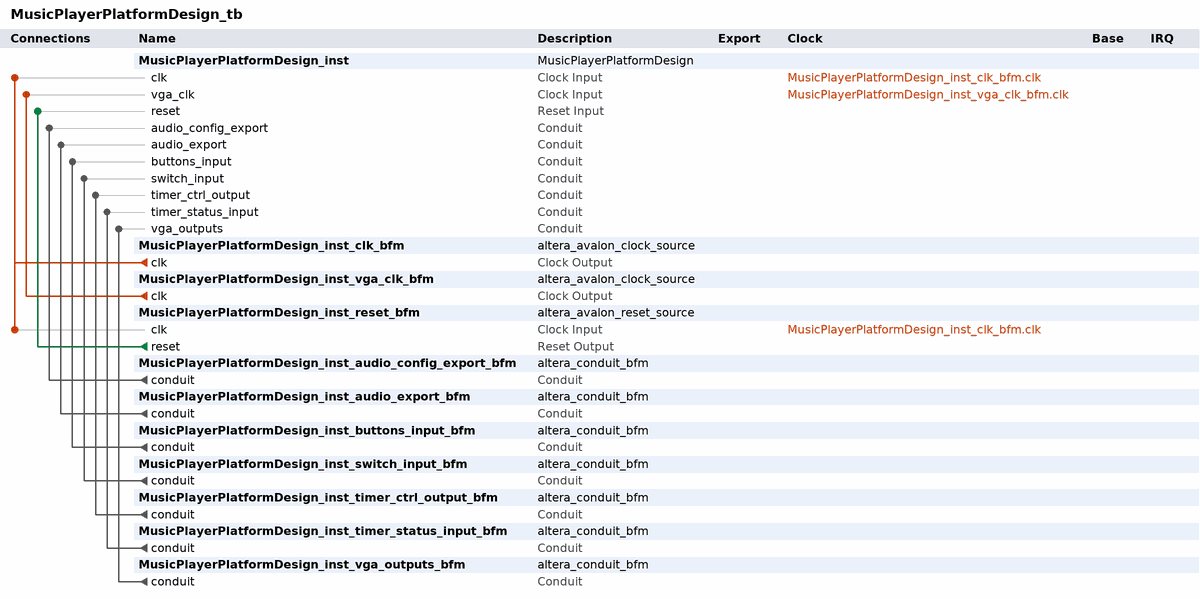
[diagram p0: system contents]
# Platform Designer (Qsys) system MusicPlayerPlatformDesign_tb, Cyclone V 5CSEMA5F31C6
# Parameters at their usual value, and those the tool derives, are not listed.
package require -exact qsys 22.1
create_system MusicPlayerPlatformDesign_tb
set_project_property DEVICE_FAMILY {Cyclone V}
set_project_property DEVICE 5CSEMA5F31C6

add_instance MusicPlayerPlatformDesign_inst MusicPlayerPlatformDesign 1.0

add_instance MusicPlayerPlatformDesign_inst_clk_bfm altera_avalon_clock_source 22.1

add_instance MusicPlayerPlatformDesign_inst_vga_clk_bfm altera_avalon_clock_source 22.1

add_instance MusicPlayerPlatformDesign_inst_reset_bfm altera_avalon_reset_source 22.1
set_instance_parameter_value MusicPlayerPlatformDesign_inst_reset_bfm ASSERT_HIGH_RESET 0
set_instance_parameter_value MusicPlayerPlatformDesign_inst_reset_bfm INITIAL_RESET_CYCLES 50

add_instance MusicPlayerPlatformDesign_inst_audio_config_export_bfm altera_conduit_bfm 22.1
set_instance_parameter_value MusicPlayerPlatformDesign_inst_audio_config_export_bfm CLOCKED_SIGNAL false
set_instance_parameter_value MusicPlayerPlatformDesign_inst_audio_config_export_bfm ENABLE_RESET false
set_instance_parameter_value MusicPlayerPlatformDesign_inst_audio_config_export_bfm SIGNAL_DIRECTIONS input,bidir
set_instance_parameter_value MusicPlayerPlatformDesign_inst_audio_config_export_bfm SIGNAL_ROLES SCLK,SDAT
set_instance_parameter_value MusicPlayerPlatformDesign_inst_audio_config_export_bfm SIGNAL_WIDTHS 1,1

add_instance MusicPlayerPlatformDesign_inst_audio_export_bfm altera_conduit_bfm 22.1
set_instance_parameter_value MusicPlayerPlatformDesign_inst_audio_export_bfm CLOCKED_SIGNAL false
set_instance_parameter_value MusicPlayerPlatformDesign_inst_audio_export_bfm ENABLE_RESET false
set_instance_parameter_value MusicPlayerPlatformDesign_inst_audio_export_bfm SIGNAL_DIRECTIONS output,input,output
set_instance_parameter_value MusicPlayerPlatformDesign_inst_audio_export_bfm SIGNAL_ROLES BCLK,DACDAT,DACLRCK
set_instance_parameter_value MusicPlayerPlatformDesign_inst_audio_export_bfm SIGNAL_WIDTHS 1,1,1

add_instance MusicPlayerPlatformDesign_inst_buttons_input_bfm altera_conduit_bfm 22.1
set_instance_parameter_value MusicPlayerPlatformDesign_inst_buttons_input_bfm CLOCKED_SIGNAL false
set_instance_parameter_value MusicPlayerPlatformDesign_inst_buttons_input_bfm ENABLE_RESET false
set_instance_parameter_value MusicPlayerPlatformDesign_inst_buttons_input_bfm SIGNAL_DIRECTIONS output
set_instance_parameter_value MusicPlayerPlatformDesign_inst_buttons_input_bfm SIGNAL_WIDTHS 4

add_instance MusicPlayerPlatformDesign_inst_switch_input_bfm altera_conduit_bfm 22.1
set_instance_parameter_value MusicPlayerPlatformDesign_inst_switch_input_bfm CLOCKED_SIGNAL false
set_instance_parameter_value MusicPlayerPlatformDesign_inst_switch_input_bfm ENABLE_RESET false
set_instance_parameter_value MusicPlayerPlatformDesign_inst_switch_input_bfm SIGNAL_DIRECTIONS output
set_instance_parameter_value MusicPlayerPlatformDesign_inst_switch_input_bfm SIGNAL_WIDTHS 1

add_instance MusicPlayerPlatformDesign_inst_timer_ctrl_output_bfm altera_conduit_bfm 22.1
set_instance_parameter_value MusicPlayerPlatformDesign_inst_timer_ctrl_output_bfm CLOCKED_SIGNAL false
set_instance_parameter_value MusicPlayerPlatformDesign_inst_timer_ctrl_output_bfm ENABLE_RESET false
set_instance_parameter_value MusicPlayerPlatformDesign_inst_timer_ctrl_output_bfm SIGNAL_DIRECTIONS input
set_instance_parameter_value MusicPlayerPlatformDesign_inst_timer_ctrl_output_bfm SIGNAL_WIDTHS 2

add_instance MusicPlayerPlatformDesign_inst_timer_status_input_bfm altera_conduit_bfm 22.1
set_instance_parameter_value MusicPlayerPlatformDesign_inst_timer_status_input_bfm CLOCKED_SIGNAL false
set_instance_parameter_value MusicPlayerPlatformDesign_inst_timer_status_input_bfm ENABLE_RESET false
set_instance_parameter_value MusicPlayerPlatformDesign_inst_timer_status_input_bfm SIGNAL_DIRECTIONS output
set_instance_parameter_value MusicPlayerPlatformDesign_inst_timer_status_input_bfm SIGNAL_WIDTHS 2

add_instance MusicPlayerPlatformDesign_inst_vga_outputs_bfm altera_conduit_bfm 22.1
set_instance_parameter_value MusicPlayerPlatformDesign_inst_vga_outputs_bfm CLOCKED_SIGNAL false
set_instance_parameter_value MusicPlayerPlatformDesign_inst_vga_outputs_bfm ENABLE_RESET false
set_instance_parameter_value MusicPlayerPlatformDesign_inst_vga_outputs_bfm SIGNAL_DIRECTIONS input,input,input,input,input,input,input,input
set_instance_parameter_value MusicPlayerPlatformDesign_inst_vga_outputs_bfm SIGNAL_ROLES B,BLANK,CLK,G,HS,R,SYNC,VS
set_instance_parameter_value MusicPlayerPlatformDesign_inst_vga_outputs_bfm SIGNAL_WIDTHS 8,1,1,8,1,8,1,1

# connections
add_connection MusicPlayerPlatformDesign_inst_clk_bfm.clk MusicPlayerPlatformDesign_inst.clk clock
add_connection MusicPlayerPlatformDesign_inst_clk_bfm.clk MusicPlayerPlatformDesign_inst_reset_bfm.clk clock
add_connection MusicPlayerPlatformDesign_inst_vga_clk_bfm.clk MusicPlayerPlatformDesign_inst.vga_clk clock
add_connection MusicPlayerPlatformDesign_inst_reset_bfm.reset MusicPlayerPlatformDesign_inst.reset reset
add_connection MusicPlayerPlatformDesign_inst_audio_config_export_bfm.conduit MusicPlayerPlatformDesign_inst.audio_config_export conduit
add_connection MusicPlayerPlatformDesign_inst_audio_export_bfm.conduit MusicPlayerPlatformDesign_inst.audio_export conduit
add_connection MusicPlayerPlatformDesign_inst_buttons_input_bfm.conduit MusicPlayerPlatformDesign_inst.buttons_input conduit
add_connection MusicPlayerPlatformDesign_inst_switch_input_bfm.conduit MusicPlayerPlatformDesign_inst.switch_input conduit
add_connection MusicPlayerPlatformDesign_inst_timer_ctrl_output_bfm.conduit MusicPlayerPlatformDesign_inst.timer_ctrl_output conduit
add_connection MusicPlayerPlatformDesign_inst_timer_status_input_bfm.conduit MusicPlayerPlatformDesign_inst.timer_status_input conduit
add_connection MusicPlayerPlatformDesign_inst_vga_outputs_bfm.conduit MusicPlayerPlatformDesign_inst.vga_outputs conduit

set_interconnect_requirement {$system} qsys_mm.clockCrossingAdapter HANDSHAKE
set_interconnect_requirement {$system} qsys_mm.enableEccProtection FALSE
set_interconnect_requirement {$system} qsys_mm.insertDefaultSlave FALSE
set_interconnect_requirement {$system} qsys_mm.maxAdditionalLatency 1

save_system MusicPlayerPlatformDesign_tb.qsys
